# EAGLE design SO8 Breakout Board (EAGLE 7.1.0)
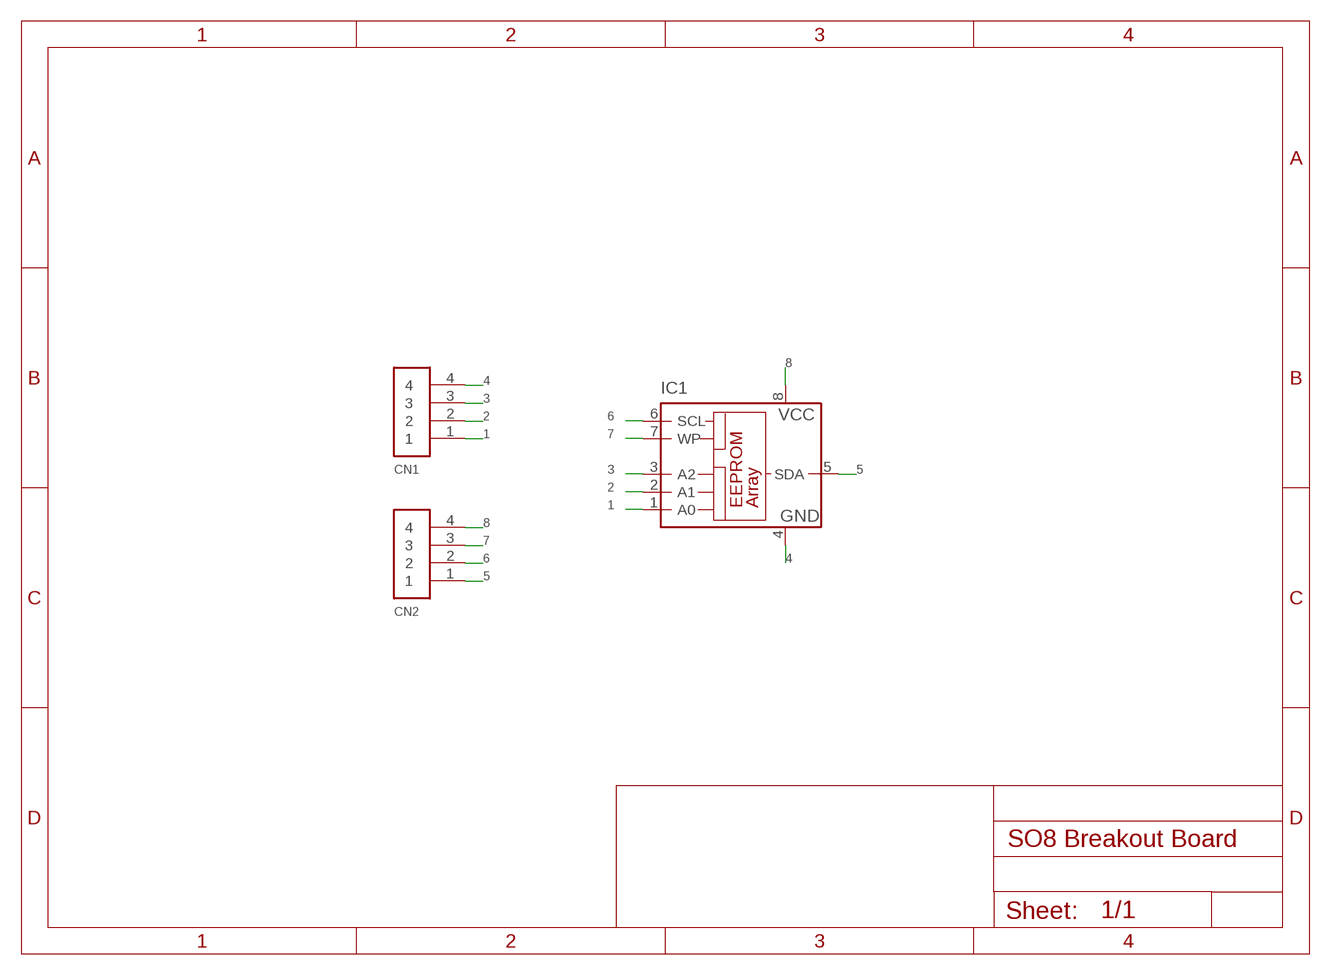
[diagram p0: schematic, sheet 1]

## Parts
CN1  1X4-BIG  [1X04-BIG]
CN2  1X4-BIG  [1X04-BIG]
IC1  24AA01SN  [SO-08]

## Nets
1: CN1.1 IC1.1(A0)
2: CN1.2 IC1.2(A1)
3: CN1.3 IC1.3(A2)
4: CN1.4 IC1.4(GND)
5: CN2.1 IC1.5(SDA)
6: CN2.2 IC1.6(SCL)
7: CN2.3 IC1.7(WP)
8: CN2.4 IC1.8(VCC)

## Library data of the parts
CN1 CN2 = adafruit:1X4: 4-pin connector
IC1 = microchip:24*: Serial EEPROM I2C; MF: MICROCHIP; MPN: 24AA01/SN; OC_FARNELL: 1331268; OC_NEWARK: 89C9792

## Board
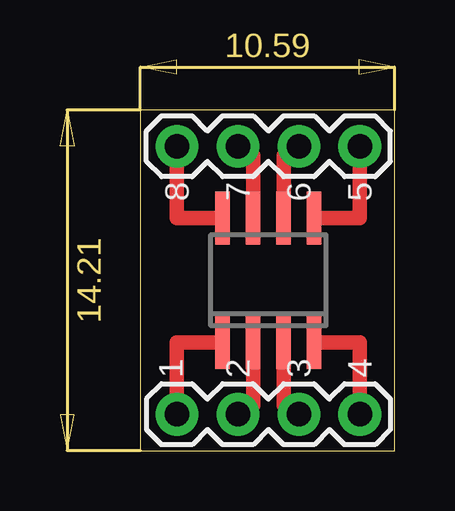
[diagram p1: board, top side]

Size 10.59 x 14.21 mm. Coordinates in mm from the lower left corner, seen from the top.
Outline: 0,0 10.59,0 10.59,14.21 0,14.21 0,0
Copper layers (1*16): Top 0.035mm / dielectric 1.5mm / Bottom 0.035mm
Design rules "default": minimum track width 10mil, minimum drill 24mil, track to track 8mil, track to pad 8mil, pad to pad 8mil, via to via 8mil, smd to smd 8mil, copper to edge 40mil, drill to drill 8mil, minimum pad ring 10mil, minimum via ring 8mil, stop-mask expansion 4mil, vias tented up to drill 0mil, thermal gap 10mil

### Footprints (pad centres in the part's own frame; a part is rotated, then mirrored left to right if it is on the bottom)
1X04-BIG = drill 1.016 pad 1.778: 1 0,0; 2 2.54,0; 3 5.08,0; 4 7.62,0
SO-08 = smd 0.6 x 2.2: 1 -1.905,-2.6; 2 -0.635,-2.6; 3 0.635,-2.6; 4 1.905,-2.6; 5 1.905,2.6; 6 0.635,2.6; 7 -0.635,2.6; 8 -1.905,2.6

### Placement (x,y rotation side)
CN1  1.52,1.52 0 top
CN2  9.14,12.7 180 top
IC1  5.33,7.11 0 top

### Tracks (layer width: path | path; a pad name or v marks a point on that pad's centre or on a via)
1
  Top 0.61: IC1.1 1.52,4.51 CN1.1
2
  Top 0.61: IC1.2 4.7,1.91 CN1.2
3
  Top 0.61: IC1.3 5.97,1.91 CN1.3
4
  Top 0.61: IC1.4 9.14,4.51 CN1.4
5
  Top 0.61: IC1.5 9.14,9.71 CN2.1
6
  Top 0.61: IC1.6 5.97,12.32 CN2.2
7
  Top 0.61: IC1.7 4.7,12.32 CN2.3
8
  Top 0.61: IC1.8 1.52,9.71 CN2.4

### Text on the board
tNames: 8 | 7 | 6 | 5 | 1 | 2 | 3 | 4